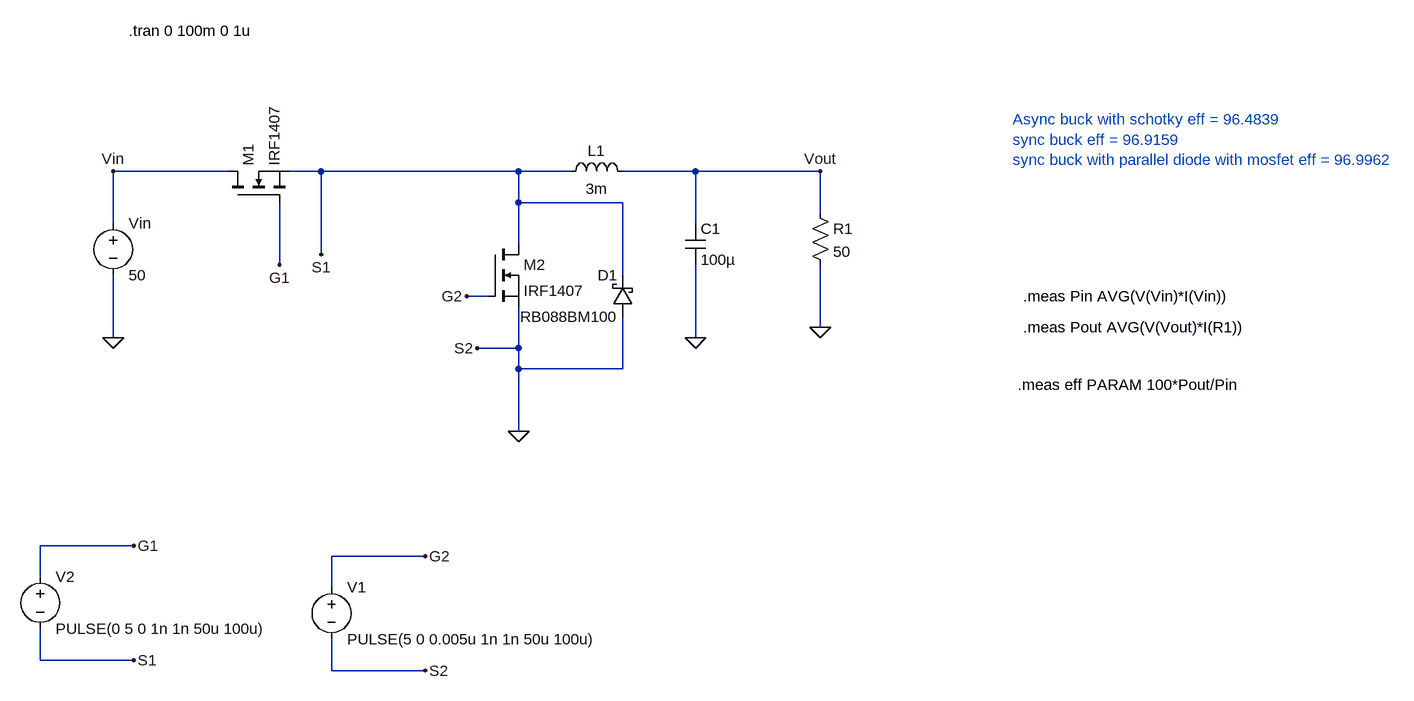
[diagram p0: schematic effeciency-calculation.asc]
effeciency-calculation.asc, the LTspice schematic file:
Version 4
SHEET 1 2100 956
WIRE -144 80 -320 80
WIRE 0 80 -48 80
WIRE 304 80 0 80
WIRE 384 80 304 80
WIRE 576 80 464 80
WIRE 768 80 576 80
WIRE 304 128 304 80
WIRE 464 128 304 128
WIRE 768 144 768 80
WIRE -320 160 -320 80
WIRE 576 160 576 80
WIRE 304 192 304 128
WIRE 0 208 0 80
WIRE -64 224 -64 128
WIRE 464 240 464 128
WIRE 256 272 224 272
WIRE 768 320 768 224
WIRE -320 336 -320 240
WIRE 576 336 576 224
WIRE 304 352 304 288
WIRE 304 352 240 352
WIRE 304 384 304 352
WIRE 464 384 464 304
WIRE 464 384 304 384
WIRE 304 480 304 384
WIRE -288 656 -432 656
WIRE 160 672 16 672
WIRE -432 704 -432 656
WIRE 16 720 16 672
WIRE -432 832 -432 784
WIRE -288 832 -432 832
WIRE 16 848 16 800
WIRE 160 848 16 848
FLAG -320 336 0
FLAG 304 480 0
FLAG 576 336 0
FLAG 768 320 0
FLAG -64 224 G1
FLAG 0 208 S1
FLAG -288 832 S1
FLAG -288 656 G1
FLAG 768 80 Vout
FLAG -320 80 Vin
FLAG 160 848 S2
FLAG 160 672 G2
FLAG 224 272 G2
FLAG 240 352 S2
SYMBOL nmos -144 128 R270
SYMATTR InstName M1
SYMATTR Value IRF1407
SYMBOL voltage -320 144 R0
WINDOW 123 0 0 Left 0
WINDOW 39 0 0 Left 0
SYMATTR InstName Vin
SYMATTR Value 50
SYMBOL ind 368 96 R270
WINDOW 0 32 56 VTop 2
WINDOW 3 5 56 VBottom 2
SYMATTR InstName L1
SYMATTR Value 3m
SYMBOL cap 560 160 R0
SYMATTR InstName C1
SYMATTR Value 100µ
SYMBOL res 752 128 R0
SYMATTR InstName R1
SYMATTR Value 50
SYMBOL voltage -432 688 R0
WINDOW 123 0 0 Left 0
WINDOW 39 0 0 Left 0
SYMATTR InstName V2
SYMATTR Value PULSE(0 5 0 1n 1n 50u 100u)
SYMBOL nmos 256 192 R0
SYMATTR InstName M2
SYMATTR Value IRF1407
SYMBOL voltage 16 704 R0
WINDOW 123 0 0 Left 0
WINDOW 39 0 0 Left 0
SYMATTR InstName V1
SYMATTR Value PULSE(5 0 0.005u 1n 1n 50u 100u)
SYMBOL schottky 480 304 R180
WINDOW 0 24 64 Left 2
WINDOW 3 24 0 Left 2
SYMATTR InstName D1
SYMATTR Value RB088BM100
SYMATTR Description Diode
SYMATTR Type diode
TEXT -296 -136 Left 2 !.tran 0 100m 0 1u
TEXT 1080 272 Left 2 !.meas Pin AVG(V(Vin)*I(Vin))
TEXT 1080 320 Left 2 !.meas Pout AVG(V(Vout)*I(R1))
TEXT 1072 408 Left 2 !.meas eff PARAM 100*Pout/Pin
TEXT 1064 0 Left 2 ;Async buck with schotky eff = 96.4839\nsync buck eff = 96.9159\nsync buck with parallel diode with mosfet eff = 96.9962

The netlist it stands for:
* effeciency-calculation.asc
M1 Vin G1 S1 S1 IRF1407
Vin Vin 0 50
L1 S1 Vout 3m
C1 Vout 0 100µ
R1 Vout 0 50
V2 G1 S1 PULSE(0 5 0 1n 1n 50u 100u)
M2 S1 G2 0 0 IRF1407
V1 G2 0 PULSE(5 0 0.005u 1n 1n 50u 100u)
D1 0 S1 RB088BM100
.model D D
.lib standard.dio
.model NMOS NMOS
.model PMOS PMOS
.lib standard.mos
.tran 0 100m 0 1u
.meas Pin AVG(V(Vin)*I(Vin))
.meas Pout AVG(V(Vout)*I(R1))
.meas eff PARAM 100*Pout/Pin
* Async buck with schotky eff = 96.4839
* sync buck eff = 96.9159
* sync buck with parallel diode with mosfet eff = 96.9962
.backanno
.end